# Altium schematic sheet TopLevel.SchDoc
size A4; SheetNumber: 3; SheetTotal: 3
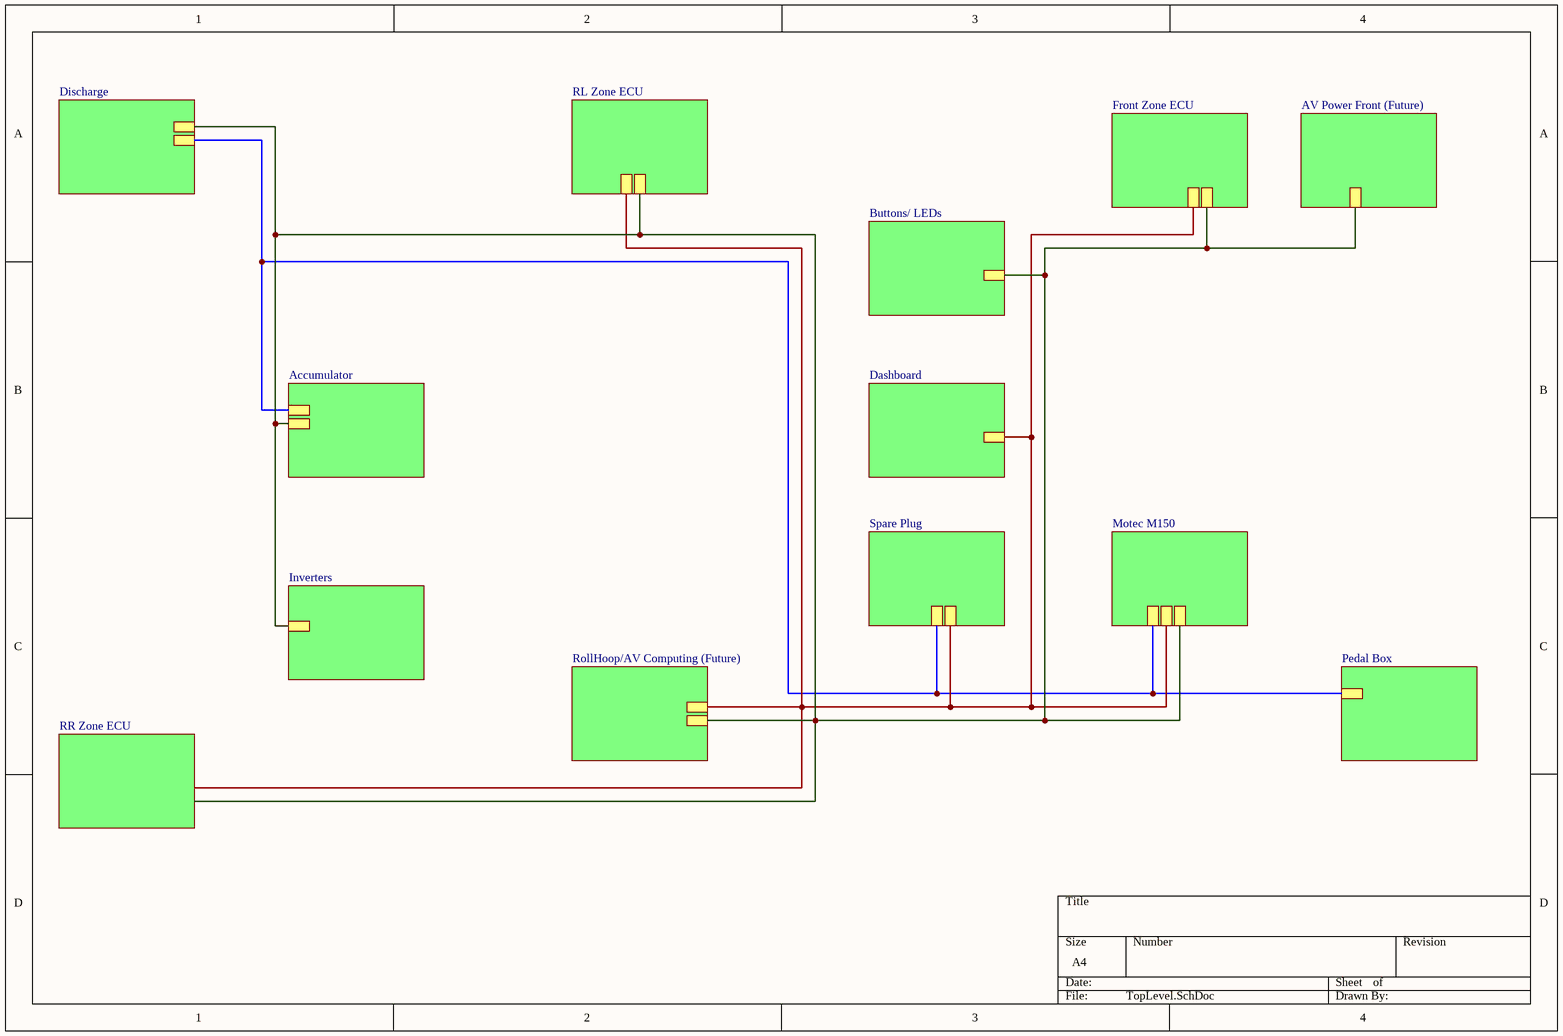
[diagram p0: TopLevel.SchDoc]

## Sub-sheets
Accumulator = File Name: , 
AV Power Front (Future) = File Name: no entries
Buttons/ LEDs = File Name: no entries
Dashboard = File Name: no entries
Discharge = File Name: , 
Front Zone ECU = File Name: , 
Inverters = File Name: no entries
Motec M150 = File Name: , , 
Pedal Box = File Name: no entries
RL Zone ECU = File Name: , 
RollHoop/AV Computing (Future) = File Name: , 
RR Zone ECU = File Name: no entries
Spare Plug = File Name: , 

## Nets
(unnamed): sheet Accumulator/, sheet Discharge/, sheet Spare Plug/, sheet Motec M150/, sheet Pedal Box/
(unnamed): sheet Accumulator/, sheet RL Zone ECU/, sheet Inverters/, sheet Discharge/, sheet RollHoop/AV Computing (Future)/, sheet Buttons/ LEDs/, sheet Front Zone ECU/, sheet AV Power Front (Future)/, sheet Motec M150/
(unnamed): sheet RL Zone ECU/, sheet RollHoop/AV Computing (Future)/, sheet Spare Plug/, sheet Dashboard/, sheet Front Zone ECU/, sheet Motec M150/